# Altium schematic sheet Geral.SchDoc
size A4
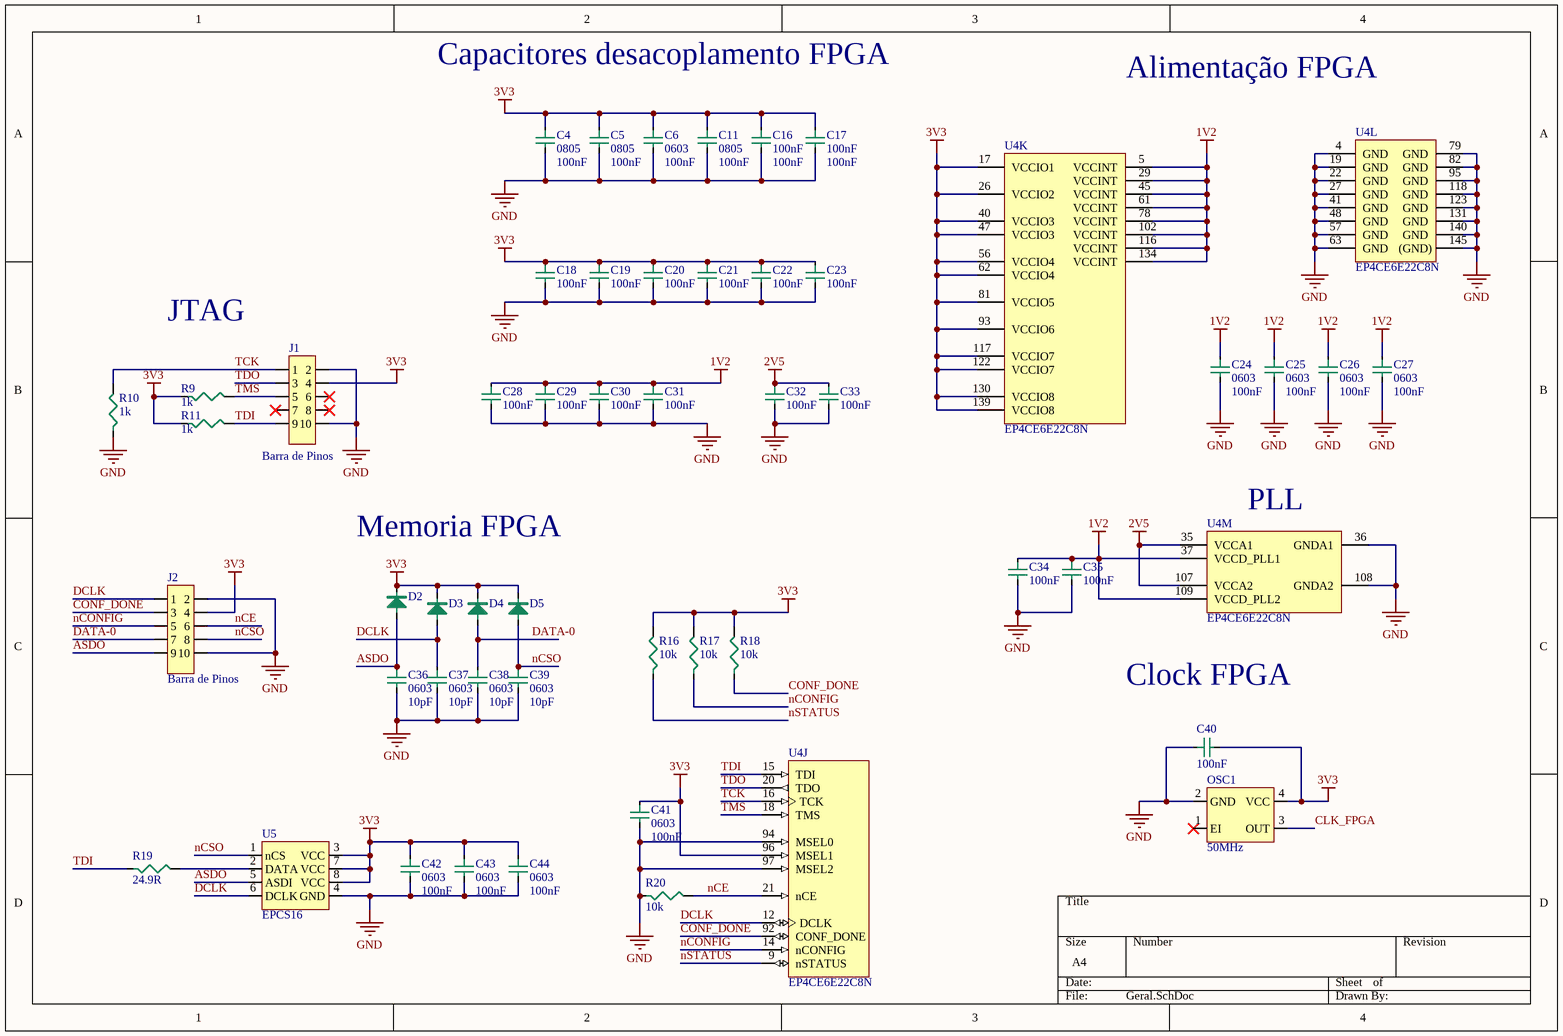
[diagram p0: Geral.SchDoc]

## Parts
C4  0805  value 100nF  [0603C]
C5  0805  value 100nF  [0603C]
C6  0603  value 100nF  [0603C]
C11  0805  value 100nF  [0603C]
C16  100nF  [0603C]
C17  100nF  [0603C]
C18  100nF  [0603C]
C19  100nF  [0603C]
C20  100nF  [0603C]
C21  100nF  [0603C]
C22  100nF  [0603C]
C23  100nF  [0603C]
C24  0603  value 100nF  [0603C]
C25  0603  value 100nF  [0603C]
C26  0603  value 100nF  [0603C]
C27  0603  value 100nF  [0603C]
C28  100nF  [0603C]
C29  100nF  [0603C]
C30  100nF  [0603C]
C31  100nF  [0603C]
C32  100nF  [0603C]
C33  100nF  [0603C]
C34  100nF  [0603C]
C35  100nF  [0603C]
C36  0603  value 10pF  [0603C]
C37  0603  value 10pF  [0603C]
C38  0603  value 10pF  [0603C]
C39  0603  value 10pF  [0603C]
C40  value 100nF  [0603C]  (hidden comment: 10pF)
C41  0603  value 100nF  [0603C]
C42  0603  value 100nF  [0603C]
C43  0603  value 100nF  [0603C]
C44  0603  value 100nF  [0603C]
D2  1N4148 SMD  [DIODE SMD LL-34]  (value not drawn)
D3  1N4148 SMD  [DIODE SMD LL-34]  (value not drawn)
D4  1N4148 SMD  [DIODE SMD LL-34]  (value not drawn)
D5  1N4148 SMD  [DIODE SMD LL-34]  (value not drawn)
J1  Barra de Pinos  [BPDC-10]
J2  Barra de Pinos  [BPDC-10]
OSC1  50MHz  [OSC CB3LV]
R9  value 1k  [0603]  (hidden comment: 0603)
R10  value 1k  [0603]  (hidden comment: 0603)
R11  value 1k  [0603]  (hidden comment: 0603)
R16  value 10k  [0603]  (hidden comment: 100R)
R17  value 10k  [0603]  (hidden comment: 1K)
R18  value 10k  [0603]  (hidden comment: 1K)
R19  value 24.9R  [0603]  (hidden comment: 1K)
R20  10K  [0603]
U4  EP4CE6E22C8N  [EQFP144_M]  (parts J,K,L,M of 13)
U5  EPCS16  [SOIC8]

## Nets
1V2: C24.1 C25.1 C26.1 C27.1 C28.2 C29.2 C30.2 C31.2 C34.2 C35.2 U4.5(VCCINT) U4.29(VCCINT) U4.37(VCCD_PLL1) U4.45(VCCINT) U4.61(VCCINT) U4.78(VCCINT) U4.102(VCCINT) U4.109(VCCD_PLL2) U4.116(VCCINT) U4.134(VCCINT)
2V5: C32.2 C33.2 U4.35(VCCA1) U4.107(VCCA2)
3V3: C4.1 C5.1 C6.1 C11.1 C16.2 C17.2 C18.2 C19.2 C20.2 C21.2 C22.2 C23.2 C40.2 C41.1 C42.1 C43.1 C44.1 D2.K D3.K D4.K D5.K J1.4 J2.4 OSC1.4(VCC) R9.1 R11.1 R16.2 R17.2 R18.2 U4.17(VCCIO1) U4.26(VCCIO2) U4.40(VCCIO3) U4.47(VCCIO3) U4.56(VCCIO4) U4.62(VCCIO4) U4.81(VCCIO5) U4.93(VCCIO6) U4.96(MSEL1) U4.117(VCCIO7) U4.122(VCCIO7) U4.130(VCCIO8) U4.139(VCCIO8) U5.3(VCC) U5.7(VCC) U5.8(VCC)
GND: C4.2 C5.2 C6.2 C11.2 C16.1 C17.1 C18.1 C19.1 C20.1 C21.1 C22.1 C23.1 C24.2 C25.2 C26.2 C27.2 C28.1 C29.1 C30.1 C31.1 C32.1 C33.1 C34.1 C35.1 C36.2 C37.2 C38.2 C39.2 C40.1 C41.2 C42.2 C43.2 C44.2 J1.2 J1.10 J2.2 J2.10 OSC1.2(GND) R10.1 R20.1 U4.4(GND) U4.19(GND) U4.22(GND) U4.27(GND) U4.36(GNDA1) U4.41(GND) U4.48(GND) U4.57(GND) U4.63(GND) U4.79(GND) U4.82(GND) U4.94(MSEL0) U4.95(GND) U4.97(MSEL2) U4.108(GNDA2) U4.118(GND) U4.123(GND) U4.131(GND) U4.140(GND) U4.145((GND)) U5.4(GND)
ASDO: C36.1 D2.A J2.9 U5.5(ASDI)
CLK_FPGA: OSC1.3(OUT)
CONF_DONE: J2.3 R18.1 U4.92(CONF_DONE)
DATA-0: C38.1 D4.A J2.7
DCLK: C37.1 D3.A J2.1 U4.12(DCLK) U5.6(DCLK)
nCE: J2.6 R20.2 U4.21(nCE)
nCONFIG: J2.5 R17.1 U4.14(nCONFIG)
nCSO: C39.1 D5.A J2.8 U5.1(nCS)
nSTATUS: R16.1 U4.9(nSTATUS)
TCK: J1.1 R10.2 U4.16(TCK)
TDI: J1.9 R11.2 R19.1 U4.15(TDI)
TDO: J1.3 U4.20(TDO)
TMS: J1.5 R9.2 U4.18(TMS)
NetR19_2: R19.2 U5.2(DATA)

Not connected (* = marked no-connect by the designer): J1 6* 7* 8*; OSC1 1(EI)*

## Notes on the sheet
- Capacitores desacoplamento FPGA
- Alimentação FPGA
- JTAG
- (near U4) PLL
- Memoria FPGA
- Clock FPGA

## Library data of the parts
C4-C6 C11 C16-C44 = Capacitor SMD 0603
  C16-C23 C28-C35: Value: 100nF
D2-D5 = Diodo Sinal SMD 1N4148: Diodo Sinal SMD LL-34
J1 J2 = Barra 5X2 Pinos PTH: Manufacturer: Metaltex; Manufacturer PN: BPSC-10; Distributor: Digikey
OSC1 = OSCILLATOR_INEP: OSC XO 50.00MHZ HCMOS TTL SMD; Supplier 1: Digi-Key; Supplier Part Number 1: CTX283LVCT-ND
R9-R11 R16-R20 = Resistor SMD 0603 1/10 W: %: ±1%; P: 1/8W
  R20: Value: 10k
U4 = EP4CE6E22C8N: IC FPGA 91 I/O 144EQFP; Supplier 1: Digi-Key; Supplier Part Number 1: 544-2746-ND
U5 = EPCS16SI8N: IC CONFIG DEVICE 16MBIT 8SOIC; Supplier 1: Digi-Key; Supplier Part Number 1: 544-2567-5-ND